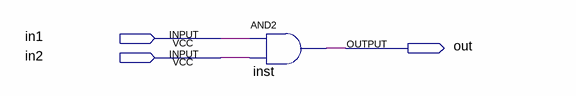
[diagram p0: schematic sheet]
// Quartus schematic andgate.bdf as structural Verilog: 1 symbols, 3 pins
module andgate (
  input  in1,
  input  in2,
  output out
);

  and inst (out, in1, in2);
endmodule
